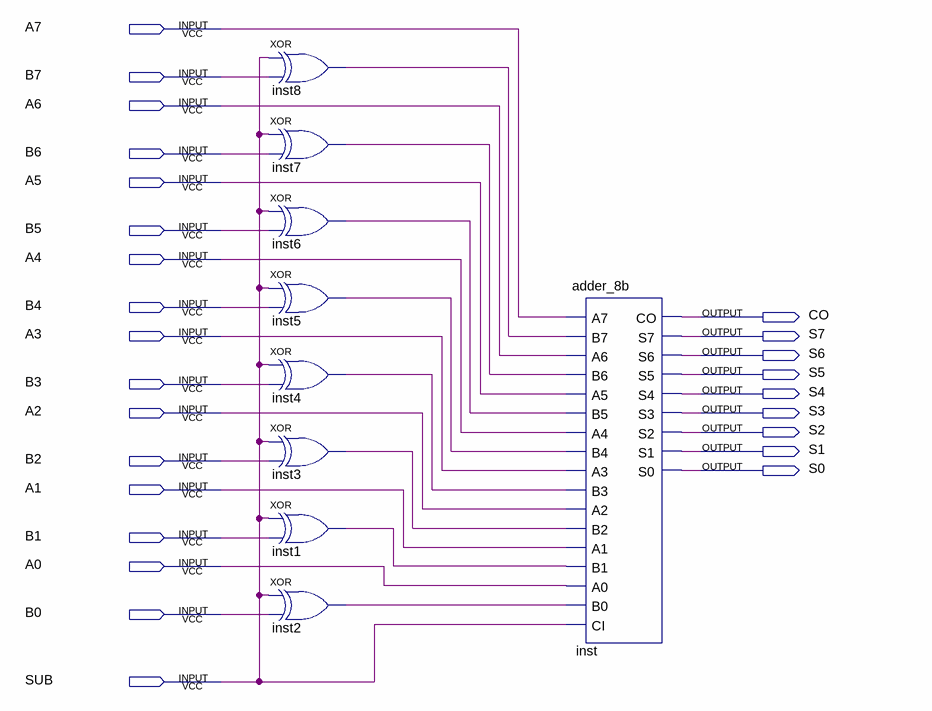
[diagram p0: schematic sheet]
// Quartus schematic adder_suber_8b.bdf as structural Verilog: 9 symbols, 26 pins
module adder_suber_8b (
  input  A7,
  input  B7,
  input  A6,
  input  B6,
  input  A5,
  input  B5,
  input  A4,
  input  B4,
  input  A3,
  input  B3,
  input  A2,
  input  B2,
  input  A1,
  input  B1,
  input  A0,
  input  B0,
  input  SUB,
  output CO,
  output S7,
  output S6,
  output S5,
  output S4,
  output S3,
  output S2,
  output S1,
  output S0
);

  wire inst1_out, inst2_out, inst3_out, inst4_out, inst5_out, inst6_out, inst7_out, inst8_out;

  xor inst8 (inst8_out, SUB, B7);
  xor inst7 (inst7_out, SUB, B6);
  xor inst6 (inst6_out, SUB, B5);
  xor inst5 (inst5_out, SUB, B4);
  xor inst4 (inst4_out, SUB, B3);
  xor inst3 (inst3_out, SUB, B2);
  xor inst1 (inst1_out, SUB, B1);
  xor inst2 (inst2_out, SUB, B0);
  adder_8b inst (
    .A7(A7), .B7(inst8_out), .A6(A6), .B6(inst7_out), .A5(A5), .B5(inst6_out), .A4(A4), .B4(inst5_out),
    .A3(A3), .B3(inst4_out), .A2(A2), .B2(inst3_out), .A1(A1), .B1(inst1_out), .A0(A0), .B0(inst2_out),
    .CI(SUB), .CO(CO), .S7(S7), .S6(S6), .S5(S5), .S4(S4), .S3(S3), .S2(S2), .S1(S1), .S0(S0));
endmodule
